# EAGLE design atx-breakout (EAGLE 7.2.0)
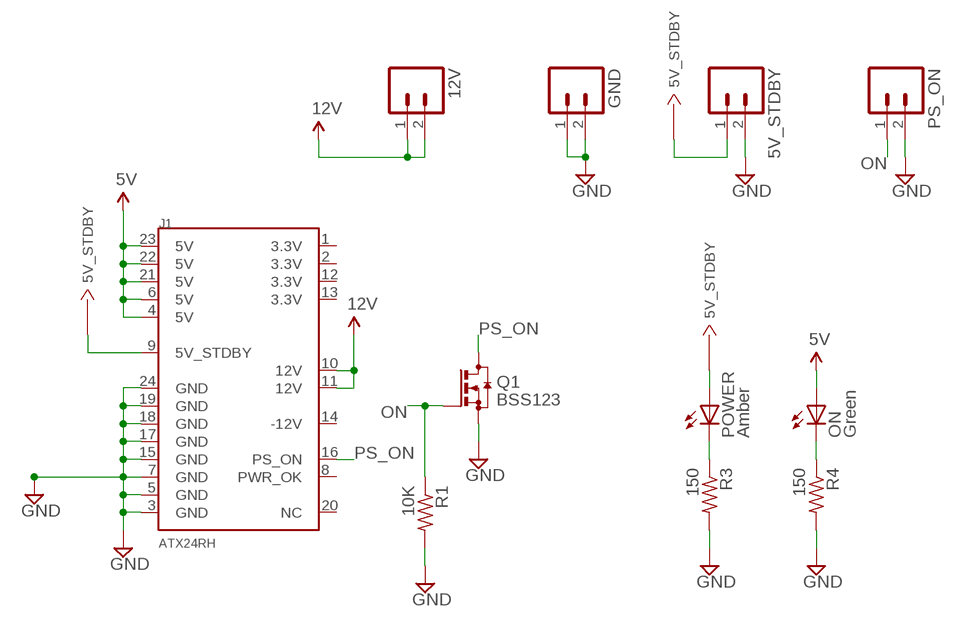
[diagram p0: schematic, sheet 1]

## Parts
5V_STDBY  M025MM  [SCREWTERMINAL-5MM-2]
12V  M025MM  [SCREWTERMINAL-5MM-2]
GND  M025MM  [SCREWTERMINAL-5MM-2]
J1  ATX24RH  [ATX24_RIGHT_ANGLE]
ON  Green  LEDCHIP-LED0805  [CHIP-LED0805]
POWER  Amber  LEDCHIP-LED0805  [CHIP-LED0805]
PS_ON  M025MM  [SCREWTERMINAL-5MM-2]
Q1  BSS123  [SOT23]
R1  10K  R-US_R0805  [R0805]
R3  150  R-US_R0805  [R0805]
R4  150  R-US_R0805  [R0805]

## Nets
5V: J1.4(5V) J1.6(5V) J1.21(5V) J1.22(5V) J1.23(5V) ON.A
5V_STDBY: 5V_STDBY.1 J1.9(5V_STDBY) POWER.A
12V: 12V.1 12V.2 J1.10(12V) J1.11(12V)
GND: 5V_STDBY.2 GND.1 GND.2 J1.3(GND) J1.5(GND) J1.7(GND) J1.15(GND) J1.17(GND) J1.18(GND) J1.19(GND) J1.24(GND) PS_ON.2 Q1.2(S) R1.2 R3.2 R4.2
N$1: POWER.C R3.1
N$2: ON.C R4.1
ON: PS_ON.1 Q1.1(G) R1.1
PS_ON: J1.16(PS_ON) Q1.3(D)
Unconnected: J1.1(3.3V) J1.2(3.3V) J1.8(PWR_OK) J1.12(3.3V) J1.13(3.3V) J1.14(-12V) J1.20(NC)

## Library data of the parts
5V_STDBY 12V GND PS_ON = SparkFun-Connectors:M02: Standard 2-pin 0.1" header. Use with - straight break away headers ( PRT-00116) - right angle break away headers (PRT-00553) - swiss pins (PRT-00743) - machine pins (PRT-00117) - female headers (PRT-00115) Molex polarized connector foot print use with: PRT-08233 with associated crimp pins and housings. 2.54_SCREWTERM for use with PRT-10571. 3.5mm Screw Terminal footprints for PRT-08084 5mm Screw Terminal footprints for use with PRT-08432; STOREFRONT_ID: PRT-08432
J1 = SparkFun-Connectors:ATX24: ATX24 Pin Power Supply Connector This is a good connector for connecting a computer power supply to a PCB. It's massive, but provides many amps of power at 5V and 12V. SKU: PRT-09498
ON POWER = led:LED: LED OSRAM: - CHIPLED LG R971, LG N971, LY N971, LG Q971, LY Q971, LO R971, LY R971 LH N974, LH R974 LS Q976, LO Q976, LY Q976 LO Q996 - Hyper CHIPLED LW Q18S LB Q993, LB Q99A, LB R99A - SideLED LS A670, LO A670, LY A670, LG A670, LP A670 LB A673, LV A673, LT A673, LW A673 LH A674 LY A675 LS A676, LA A676, LO A676, LY A676, LW A676 LS A679, LY A679, LG A679 - Hyper Micro SIDELED® LS Y876, LA Y876, LO Y876, LY Y876 LT Y87S - SmartLED LW L88C, LW L88S LB L89C, LB L89S, LG L890 LS L89K, LO L89K, LY L89K LS L896, LA L896, LO L896, LY L896 - TOPLED LS T670, LO T670, LY T670, LG T670, LP T670 LSG T670, LSP T670, LSY T670, LOP T670, LYG T670 LG T671, LOG T671, LSG T671 LB T673, LV T673, LT T673, LW T673 LH T674 LS T676, LA T676, LO T676, LY T676, LB T676, LH T676, LSB T676, LW T676 LB T67C, LV T67C, LT T67C, LS T67K, LO T67K, LY T67K, LW E67C LS E67B, LA E67B, LO E67B, LY E67B, LB E67C, LV E67C, LT E67C LW T67C LS T679, LY T679, LG T679 LS T770, LO T770, LY T770, LG T770, LP T770 LB T773, LV T773, LT T773, LW T773 LH T774 LS E675, LA E675, LY E675, LS T675 LS T776, LA T776, LO T776, LY T776, LB T776 LHGB T686 LT T68C, LB T68C - Hyper Mini TOPLED® LB M676 - Mini TOPLED Santana® LG M470 LS M47K, LO M47K, LY M47K Source: http://www.osram.convergy.de LUXEON: - LUMILED® LXK2-PW12-R00, LXK2-PW12-S00, LXK2-PW14-U00, LXK2-PW14-V00 LXK2-PM12-R00, LXK2-PM12-S00, LXK2-PM14-U00 LXK2-PE12-Q00, LXK2-PE12-R00, LXK2-PE12-S00, LXK2-PE14-T00, LXK2-PE14-U00 LXK2-PB12-K00, LXK2-PB12-L00, LXK2-PB12-M00, LXK2-PB14-N00, LXK2-PB14-P00, LXK2-PB14-Q00 LXK2-PR12-L00, LXK2-PR12-M00, LXK2-PR14-Q00, LXK2-PR14-R00 LXK2-PD12-Q00, LXK2-PD12-R00, LXK2-PD12-S00 LXK2-PH12-R00, LXK2-PH12-S00 LXK2-PL12-P00, LXK2-PL12-Q00, LXK2-PL12-R00 Source: www.luxeon.com KINGBRIGHT: KA-3528ASYC Source: www.kingbright.com
Q1 = transistor-small-signal:BSS123: N-CHANNEL MOS FET
R1 R3 R4 = resistor:R-US_: RESISTOR, American symbol

## Board
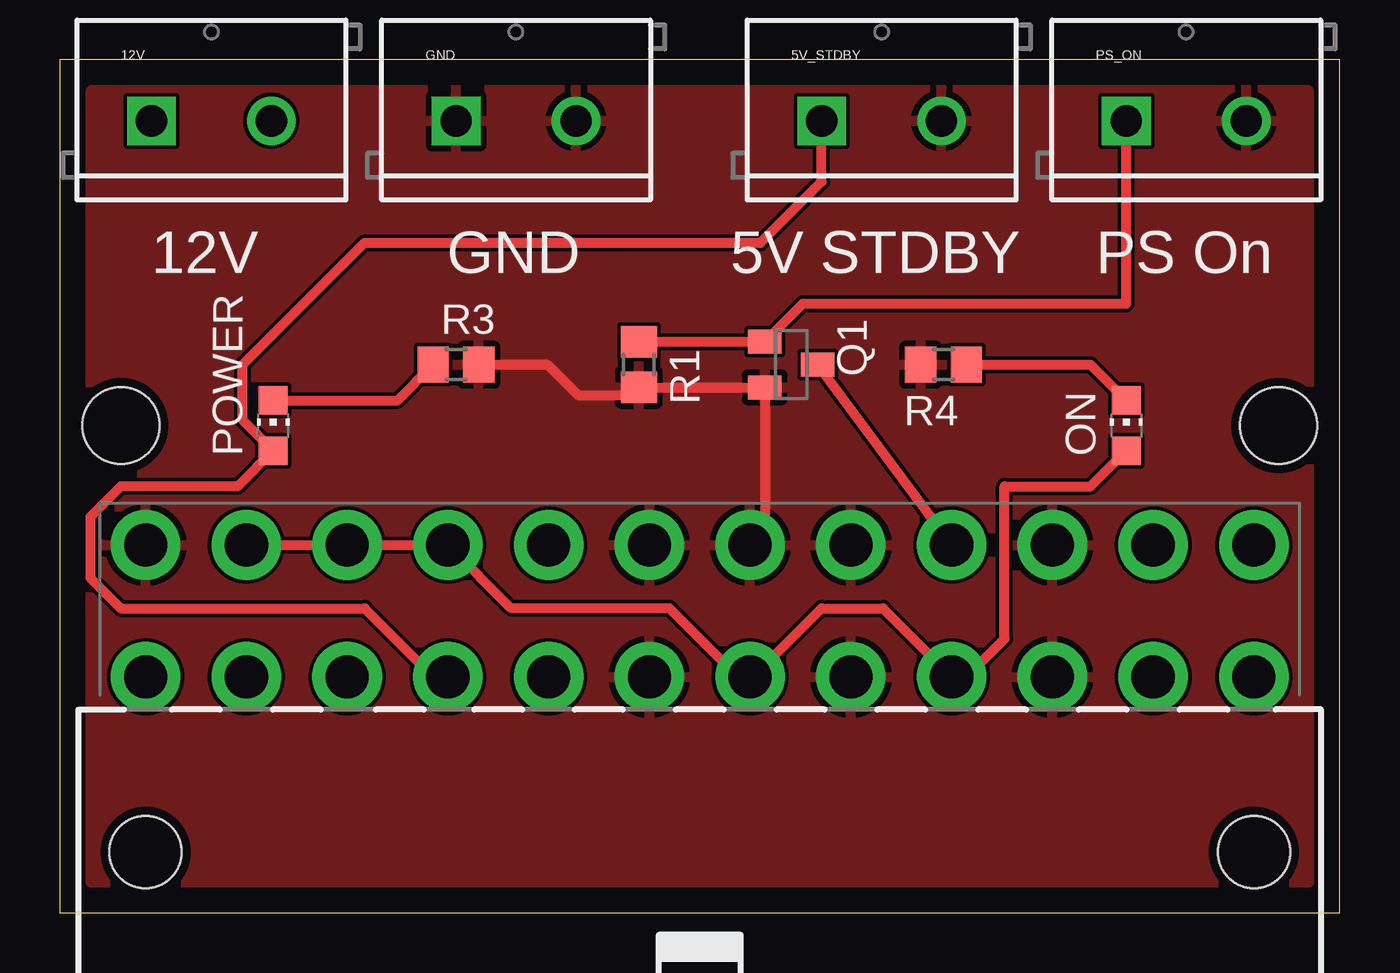
[diagram p1: board, top side]
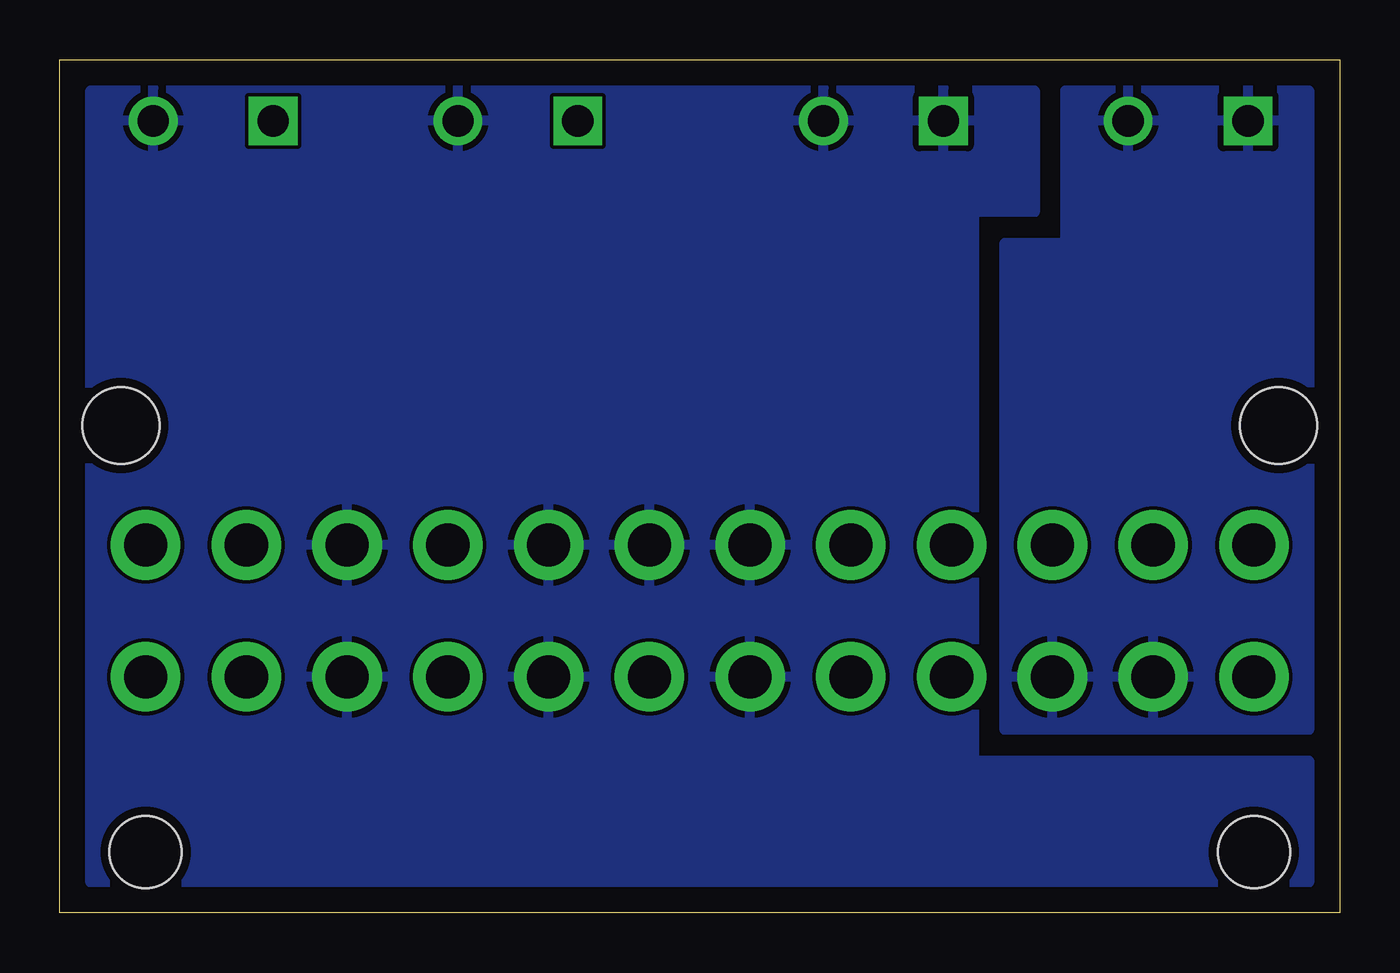
[diagram p2: board, bottom side, seen from below]

Size 53.34 x 35.56 mm. Coordinates in mm from the lower left corner, seen from the top.
Outline: 0,0 53.34,0 53.34,35.56 0,35.56 0,0
Copper layers (1*16): Top 0.0356mm / dielectric 1.5011mm / Bottom 0.0356mm
Design rules "oshpark *": minimum track width 6mil, minimum drill 13mil, track to track 6mil, track to pad 6mil, pad to pad 6mil, via to via 6mil, smd to smd 6mil, copper to edge 15mil, drill to drill 6mil, minimum pad ring 7mil, minimum via ring 7mil, stop-mask expansion 3mil, vias tented up to drill 15mil, thermal gap 10mil
Holes 3.2 mm at 2.54,20.32 50.8,20.32

### Footprints (pad centres in the part's own frame; a part is rotated, then mirrored left to right if it is on the bottom)
SCREWTERMINAL-5MM-2 = drill 1.3 pad 2.032 square: 1 0,0 | drill 1.3 pad 2.032: 2 5,0
ATX24_RIGHT_ANGLE = drill 1.8 pad 2.9: 1 23.1,4.76; 2 18.9,4.76; 3 14.7,4.76; 4 10.5,4.76; 5 6.3,4.76; 6 2.1,4.76; 7 -2.1,4.76; 8 -6.3,4.76; 9 -10.5,4.76; 10 -14.7,4.76; 11 -18.9,4.76; 12 -23.1,4.76; 13 23.1,10.26; 14 18.9,10.26; 15 14.7,10.26; 16 10.5,10.26; 17 6.3,10.26; 18 2.1,10.26; 19 -2.1,10.26; 20 -6.3,10.26; 21 -10.5,10.26; 22 -14.7,10.26; 23 -18.9,10.26; 24 -23.1,10.26 | hole 3: -23.1,-2.54; 23.1,-2.54
CHIP-LED0805 = smd 1.2 x 1.2: A 0,-1.05; C 0,1.05
SOT23 = smd 1 x 1.4: 1 -0.95,-1.1; 2 0.95,-1.1; 3 0,1.1
R0805 = smd 1.3 x 1.5: 1 -0.95,0; 2 0.95,0

### Placement (x,y rotation side)
5V_STDBY  31.75,33.02 0 top
12V  3.81,33.02 0 top
GND  16.51,33.02 0 top
J1  26.67,5.08 0 top
ON  44.45,20.32 0 top
POWER  8.89,20.32 0 top
PS_ON  44.45,33.02 0 top
Q1  30.48,22.86 270 top
R1  24.13,22.86 270 top
R3  16.51,22.86 0 top
R4  36.83,22.86 180 top

### Tracks (layer width: path | path; a pad name or v marks a point on that pad's centre or on a via)
5V
  Top 0.406: J1.23 J1.22 J1.21 18.81,12.7 25.4,12.7 28.26,9.84 J1.6 28.89,9.84 31.75,12.7 34.31,12.7 J1.4 37.78,9.84 39.37,11.43 39.37,17.78 42.96,17.78 ON.A
5V_STDBY
  Top 0.406: J1.9 15.56,9.84 12.7,12.7 2.54,12.7 1.27,13.97 1.27,16.51 2.54,17.78 7.4,17.78 POWER.A 7.62,20.54 7.62,22.86 12.7,27.94 29.21,27.94 31.75,30.48 5V_STDBY.1
12V
  pour Bottom: 1.27,34.29 1.27,7.62 13.97,7.62 13.97,27.94 11.43,27.94 11.43,34.29
GND
  Top 0.406: R3.2 20.32,22.86 21.59,21.59 23.81,21.59 R1.2 Q1.2 29.38,15.95 J1.18
  pour Bottom: 12.7,34.29 12.7,29.21 15.24,29.21 15.24,6.35 1.27,6.35 1.27,1.27 52.07,1.27 52.07,34.29
  pour Top: 1.27,34.29 1.27,1.27 52.07,1.27 52.07,34.29
N$1
  Top 0.406: POWER.C 14.07,21.37 R3.1
N$2
  Top 0.406: R4.1 42.96,22.86 ON.C
ON
  Top 0.406: R1.1 Q1.1 30.97,25.4 44.45,25.4 PS_ON.1
PS_ON
  Top 0.406: Q1.3 J1.16

### Text on the board
_tsilk: 12V | GND | 5V STDBY | PS On